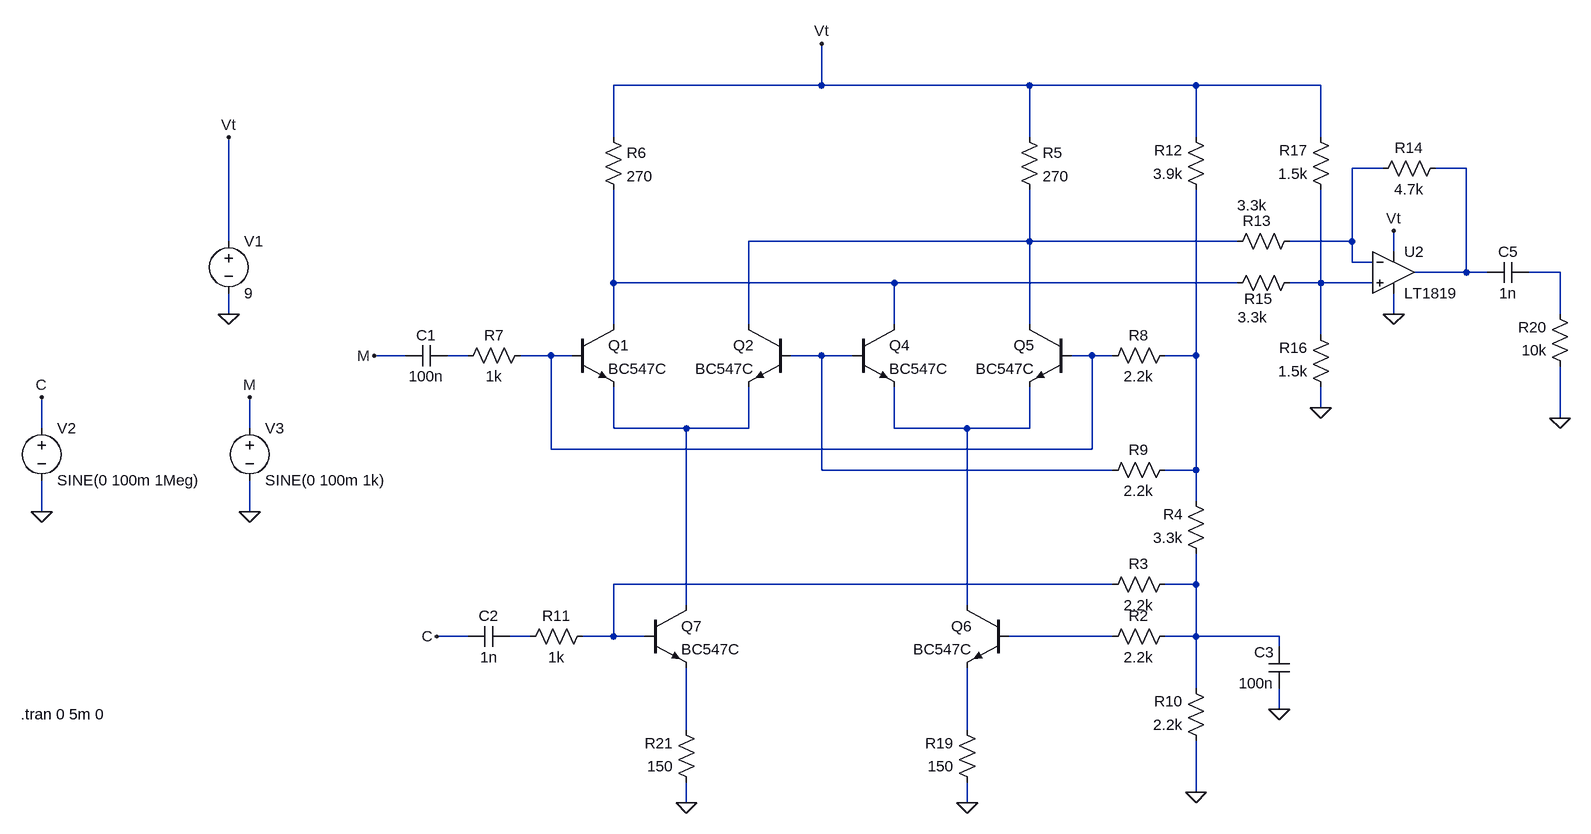
[diagram p0: schematic gilbert-cell.asc]
gilbert-cell.asc, the LTspice schematic file:
Version 4
SHEET 1 1928 932
WIRE 560 -416 560 -480
WIRE 560 -416 240 -416
WIRE 880 -416 560 -416
WIRE 1136 -416 880 -416
WIRE 1328 -416 1136 -416
WIRE 240 -336 240 -416
WIRE 880 -336 880 -416
WIRE 1136 -336 1136 -416
WIRE 1328 -336 1328 -416
WIRE 1424 -288 1376 -288
WIRE 1552 -288 1504 -288
WIRE -352 -176 -352 -336
WIRE 880 -176 880 -256
WIRE 880 -176 448 -176
WIRE 1200 -176 880 -176
WIRE 1376 -176 1376 -288
WIRE 1376 -176 1280 -176
WIRE 1440 -160 1440 -192
WIRE 1376 -144 1376 -176
WIRE 1408 -144 1376 -144
WIRE 1552 -128 1552 -288
WIRE 1552 -128 1472 -128
WIRE 1584 -128 1552 -128
WIRE 1696 -128 1648 -128
WIRE 240 -112 240 -256
WIRE 672 -112 240 -112
WIRE 1200 -112 672 -112
WIRE 1328 -112 1328 -256
WIRE 1328 -112 1280 -112
WIRE 1408 -112 1328 -112
WIRE -352 -64 -352 -96
WIRE 1440 -64 1440 -96
WIRE 1696 -64 1696 -128
WIRE 240 -48 240 -112
WIRE 448 -48 448 -176
WIRE 672 -48 672 -112
WIRE 880 -48 880 -176
WIRE 1328 -32 1328 -112
WIRE -80 0 -128 0
WIRE 16 0 -16 0
WIRE 144 0 96 0
WIRE 176 0 144 0
WIRE 560 0 512 0
WIRE 608 0 560 0
WIRE 976 0 944 0
WIRE 1008 0 976 0
WIRE 1136 0 1136 -256
WIRE 1136 0 1088 0
WIRE 1328 80 1328 48
WIRE 1696 96 1696 16
WIRE -640 112 -640 64
WIRE -320 112 -320 64
WIRE 240 112 240 48
WIRE 352 112 240 112
WIRE 448 112 448 48
WIRE 448 112 352 112
WIRE 672 112 672 48
WIRE 784 112 672 112
WIRE 880 112 880 48
WIRE 880 112 784 112
WIRE 144 144 144 0
WIRE 976 144 976 0
WIRE 976 144 144 144
WIRE 560 176 560 0
WIRE 1008 176 560 176
WIRE 1136 176 1136 0
WIRE 1136 176 1088 176
WIRE 1136 224 1136 176
WIRE -640 240 -640 192
WIRE -320 240 -320 192
WIRE 1008 352 240 352
WIRE 1136 352 1136 304
WIRE 1136 352 1088 352
WIRE 352 384 352 112
WIRE 784 384 784 112
WIRE 16 432 -32 432
WIRE 112 432 80 432
WIRE 240 432 240 352
WIRE 240 432 192 432
WIRE 288 432 240 432
WIRE 1008 432 848 432
WIRE 1136 432 1136 352
WIRE 1136 432 1088 432
WIRE 1264 432 1136 432
WIRE 1264 448 1264 432
WIRE 1136 512 1136 432
WIRE 1264 544 1264 512
WIRE 352 576 352 480
WIRE 784 576 784 480
WIRE 1136 672 1136 592
WIRE 352 688 352 656
WIRE 784 688 784 656
FLAG -352 -64 0
FLAG -352 -336 Vt
FLAG -640 240 0
FLAG -640 64 C
FLAG -320 240 0
FLAG -320 64 M
FLAG -128 0 M
FLAG 1136 672 0
FLAG -32 432 C
FLAG 560 -480 Vt
FLAG 1440 -192 Vt
FLAG 1440 -64 0
FLAG 1328 80 0
FLAG 1264 544 0
FLAG 1696 96 0
FLAG 784 688 0
FLAG 352 688 0
SYMBOL npn 176 -48 R0
SYMATTR InstName Q1
SYMATTR Value BC547C
SYMBOL npn 512 -48 M0
SYMATTR InstName Q2
SYMATTR Value BC547C
SYMBOL res 0 16 R270
WINDOW 0 32 56 VTop 2
WINDOW 3 0 56 VBottom 2
SYMATTR InstName R7
SYMATTR Value 1k
SYMBOL voltage -352 -192 R0
WINDOW 123 0 0 Left 0
WINDOW 39 0 0 Left 0
SYMATTR InstName V1
SYMATTR Value 9
SYMBOL voltage -640 96 R0
WINDOW 123 0 0 Left 0
WINDOW 39 0 0 Left 0
SYMATTR InstName V2
SYMATTR Value SINE(0 100m 1Meg)
SYMBOL voltage -320 96 R0
WINDOW 123 0 0 Left 0
WINDOW 39 0 0 Left 0
SYMATTR InstName V3
SYMATTR Value SINE(0 100m 1k)
SYMBOL npn 608 -48 R0
SYMATTR InstName Q4
SYMATTR Value BC547C
SYMBOL npn 944 -48 M0
SYMATTR InstName Q5
SYMATTR Value BC547C
SYMBOL npn 848 384 M0
SYMATTR InstName Q6
SYMATTR Value BC547C
SYMBOL npn 288 384 R0
SYMATTR InstName Q7
SYMATTR Value BC547C
SYMBOL res 1104 416 R90
WINDOW 0 0 56 VBottom 2
WINDOW 3 32 56 VTop 2
SYMATTR InstName R2
SYMATTR Value 2.2k
SYMBOL res 1104 336 R90
WINDOW 0 0 56 VBottom 2
WINDOW 3 32 56 VTop 2
SYMATTR InstName R3
SYMATTR Value 2.2k
SYMBOL res 1152 320 R180
WINDOW 0 36 76 Left 2
WINDOW 3 36 40 Left 2
SYMATTR InstName R4
SYMATTR Value 3.3k
SYMBOL res 1104 -16 R90
WINDOW 0 0 56 VBottom 2
WINDOW 3 32 56 VTop 2
SYMATTR InstName R8
SYMATTR Value 2.2k
SYMBOL res 1104 160 R90
WINDOW 0 0 56 VBottom 2
WINDOW 3 32 56 VTop 2
SYMATTR InstName R9
SYMATTR Value 2.2k
SYMBOL res 1152 608 R180
WINDOW 0 36 76 Left 2
WINDOW 3 36 40 Left 2
SYMATTR InstName R10
SYMATTR Value 2.2k
SYMBOL res 96 448 R270
WINDOW 0 32 56 VTop 2
WINDOW 3 0 56 VBottom 2
SYMATTR InstName R11
SYMATTR Value 1k
SYMBOL res 864 -352 R0
SYMATTR InstName R5
SYMATTR Value 270
SYMBOL res 224 -352 R0
SYMATTR InstName R6
SYMATTR Value 270
SYMBOL cap -16 -16 R90
WINDOW 0 0 32 VBottom 2
WINDOW 3 32 32 VTop 2
SYMATTR InstName C1
SYMATTR Value 100n
SYMBOL cap 80 416 R90
WINDOW 0 0 32 VBottom 2
WINDOW 3 32 32 VTop 2
SYMATTR InstName C2
SYMATTR Value 1n
SYMBOL res 1152 -240 R180
WINDOW 0 36 76 Left 2
WINDOW 3 36 40 Left 2
SYMATTR InstName R12
SYMATTR Value 3.9k
SYMBOL res 1296 -192 R90
WINDOW 0 0 66 VBottom 2
WINDOW 3 -55 74 VTop 2
SYMATTR InstName R13
SYMATTR Value 3.3k
SYMBOL res 1520 -304 R90
WINDOW 0 0 56 VBottom 2
WINDOW 3 32 56 VTop 2
SYMATTR InstName R14
SYMATTR Value 4.7k
SYMBOL res 1296 -128 R90
WINDOW 0 56 64 VBottom 2
WINDOW 3 53 73 VTop 2
SYMATTR InstName R15
SYMATTR Value 3.3k
SYMBOL res 1344 64 R180
WINDOW 0 36 76 Left 2
WINDOW 3 36 40 Left 2
SYMATTR InstName R16
SYMATTR Value 1.5k
SYMBOL res 1344 -240 R180
WINDOW 0 36 76 Left 2
WINDOW 3 36 40 Left 2
SYMATTR InstName R17
SYMATTR Value 1.5k
SYMBOL OpAmps\\LT1819 1440 -128 R0
SYMATTR InstName U2
SYMBOL cap 1280 512 R180
WINDOW 0 24 56 Left 2
WINDOW 3 24 8 Left 2
SYMATTR InstName C3
SYMATTR Value 100n
SYMBOL cap 1648 -144 R90
WINDOW 0 0 32 VBottom 2
WINDOW 3 32 32 VTop 2
SYMATTR InstName C5
SYMATTR Value 1n
SYMBOL res 1712 32 R180
WINDOW 0 36 76 Left 2
WINDOW 3 36 40 Left 2
SYMATTR InstName R20
SYMATTR Value 10k
SYMBOL res 800 672 R180
WINDOW 0 36 76 Left 2
WINDOW 3 36 40 Left 2
SYMATTR InstName R19
SYMATTR Value 150
SYMBOL res 368 672 R180
WINDOW 0 36 76 Left 2
WINDOW 3 36 40 Left 2
SYMATTR InstName R21
SYMATTR Value 150
TEXT -672 552 Left 2 !.tran 0 5m 0

The netlist it stands for:
* gilbert-cell.asc
Q1 N005 N008 N011 0 BC547C
Q2 N003 N009 N011 0 BC547C
R7 N007 N008 1k
V1 Vt 0 9
V2 C 0 SINE(0 100m 1Meg)
V3 M 0 SINE(0 100m 1k)
Q4 N005 N009 N012 0 BC547C
Q5 N003 N008 N012 0 BC547C
Q6 N012 N016 N018 0 BC547C
Q7 N011 N013 N017 0 BC547C
R2 N014 N016 2.2k
R3 N014 N013 2.2k
R4 N014 N010 3.3k
R8 N010 N008 2.2k
R9 N010 N009 2.2k
R10 0 N014 2.2k
R11 N015 N013 1k
R5 Vt N003 270
R6 Vt N005 270
C1 N007 M 100n
C2 N015 C 1n
R12 N010 Vt 3.9k
R13 N001 N003 3.3k
R14 N002 N001 4.7k
R15 N006 N005 3.3k
R16 0 N006 1.5k
R17 N006 Vt 1.5k
* U2: LT1819 (symbol OpAmps\LT1819 not available, pins judged from their places): In+=N006 In-=N001 V+=Vt V-=0 OUT=N002
C3 0 N014 100n
C5 N004 N002 1n
R20 0 N004 10k
R19 0 N018 150
R21 0 N017 150
.model NPN NPN
.model PNP PNP
.lib standard.bjt
.tran 0 5m 0
.backanno
.end